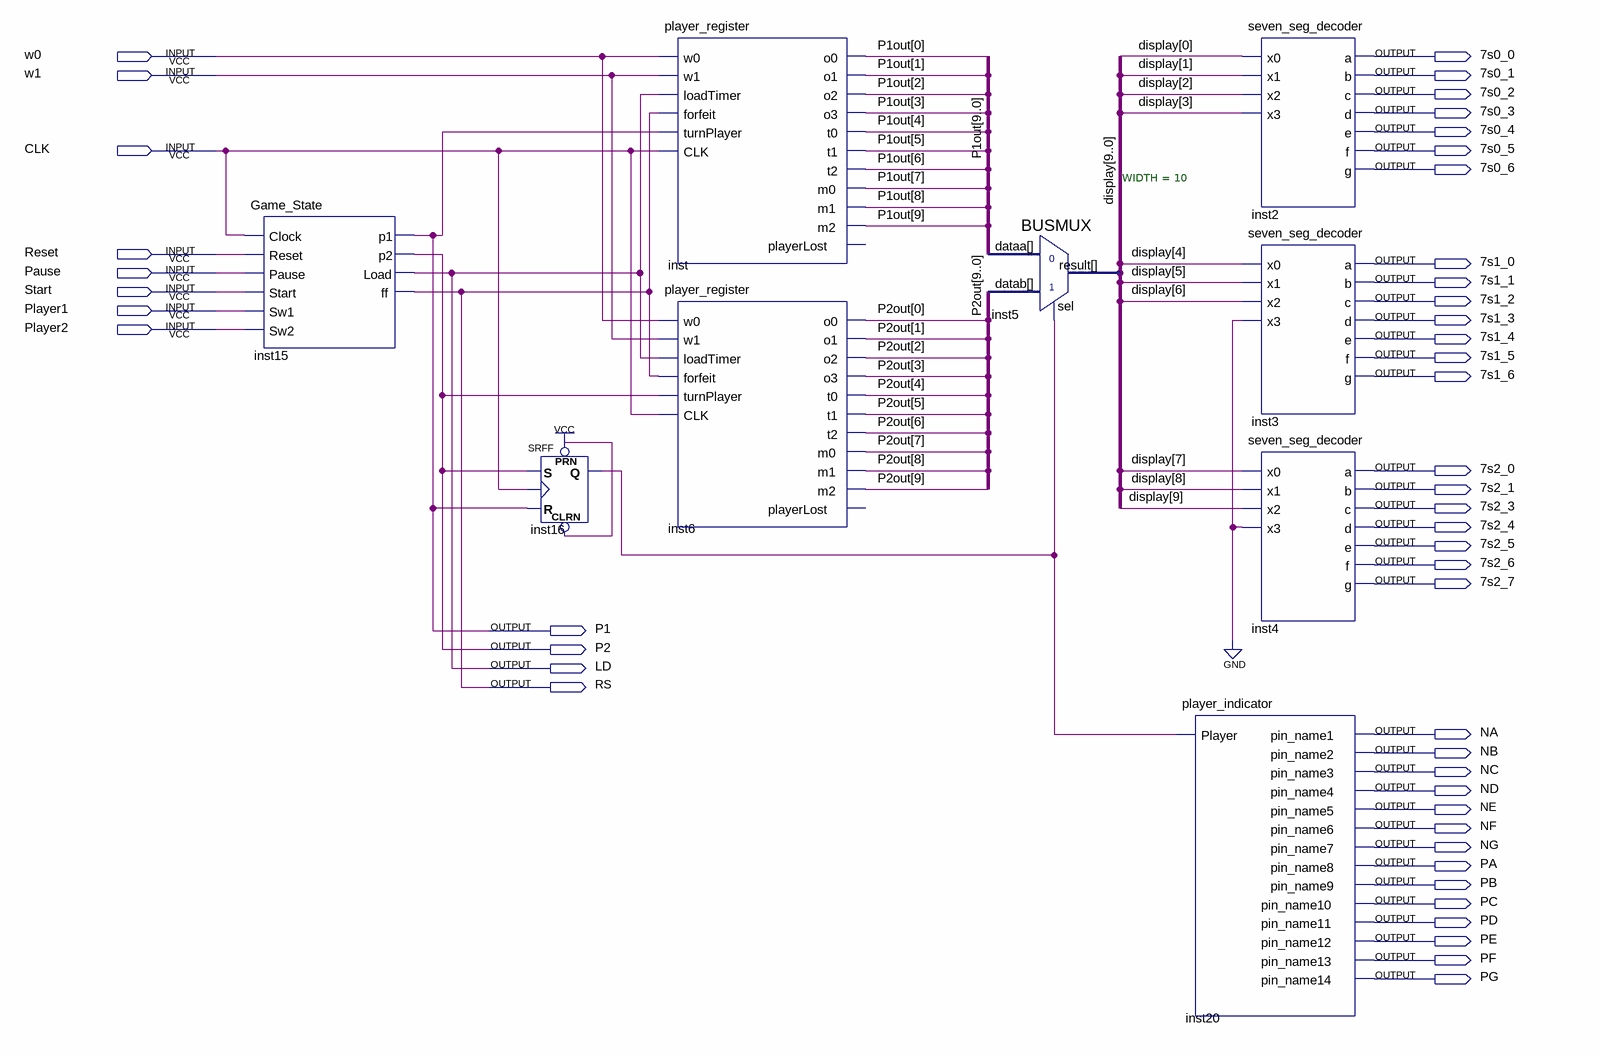
[diagram p0: schematic sheet]
// Quartus schematic finalproject.bdf as structural Verilog: 9 symbols, 47 pins
module finalproject (
  input  w0,
  input  w1,
  input  CLK,
  input  Reset,
  input  Pause,
  input  Start,
  input  Player1,
  input  Player2,
  output \7s0_0 ,
  output \7s0_1 ,
  output \7s0_2 ,
  output \7s0_3 ,
  output \7s0_4 ,
  output \7s0_5 ,
  output \7s0_6 ,
  output \7s1_0 ,
  output \7s1_1 ,
  output \7s1_2 ,
  output \7s1_3 ,
  output \7s1_4 ,
  output \7s1_5 ,
  output \7s1_6 ,
  output \7s2_0 ,
  output \7s2_1 ,
  output \7s2_3 ,
  output \7s2_4 ,
  output \7s2_5 ,
  output \7s2_6 ,
  output \7s2_7 ,
  output P1,
  output P2,
  output LD,
  output RS,
  output NA,
  output NB,
  output NC,
  output ND,
  output NE,
  output NF,
  output NG,
  output PA,
  output PB,
  output PC,
  output PD,
  output PE,
  output PF,
  output PG
);

  wire inst16_q;
  wire [9:0] display, P1out, P2out;

  Game_State inst15 (
    .Clock(CLK), .Reset(Reset), .Pause(Pause), .Start(Start), .Sw1(Player1), .Sw2(Player2), .p1(P1), .p2(P2),
    .Load(LD), .ff(RS));
  SRFF inst16 (.PRN(1'b1), .CLRN(1'b1), .S(P2), .R(P1), .CLK(CLK), .Q(inst16_q));
  player_register inst (
    .w0(w0), .w1(w1), .loadTimer(LD), .forfeit(RS), .turnPlayer(P1), .CLK(CLK), .o0(P1out[0]), .o1(P1out[1]),
    .o2(P1out[2]), .o3(P1out[3]), .t0(P1out[4]), .t1(P1out[5]), .t2(P1out[6]), .m0(P1out[7]), .m1(P1out[8]),
    .m2(P1out[9]));  // open: playerLost
  player_register inst6 (
    .w0(w0), .w1(w1), .loadTimer(LD), .forfeit(RS), .turnPlayer(P2), .CLK(CLK), .o0(P2out[0]), .o1(P2out[1]),
    .o2(P2out[2]), .o3(P2out[3]), .t0(P2out[4]), .t1(P2out[5]), .t2(P2out[6]), .m0(P2out[7]), .m1(P2out[8]),
    .m2(P2out[9]));  // open: playerLost
  BUSMUX #(.WIDTH(10)) inst5 (.datab(P2out), .sel(inst16_q), .dataa(P1out), .result(display));
  player_indicator inst20 (
    .Player(inst16_q), .pin_name1(NA), .pin_name2(NB), .pin_name3(NC), .pin_name4(ND), .pin_name5(NE),
    .pin_name6(NF), .pin_name7(NG), .pin_name8(PA), .pin_name9(PB), .pin_name10(PC), .pin_name11(PD),
    .pin_name12(PE), .pin_name13(PF), .pin_name14(PG));
  seven_seg_decoder inst2 (
    .x0(display[0]), .x1(display[1]), .x2(display[2]), .x3(display[3]), .a(\7s0_0 ), .b(\7s0_1 ),
    .c(\7s0_2 ), .d(\7s0_3 ), .e(\7s0_4 ), .f(\7s0_5 ), .g(\7s0_6 ));
  seven_seg_decoder inst3 (
    .x0(display[4]), .x1(display[5]), .x2(display[6]), .x3(1'b0), .a(\7s1_0 ), .b(\7s1_1 ), .c(\7s1_2 ),
    .d(\7s1_3 ), .e(\7s1_4 ), .f(\7s1_5 ), .g(\7s1_6 ));
  seven_seg_decoder inst4 (
    .x0(display[7]), .x1(display[8]), .x2(display[9]), .x3(1'b0), .a(\7s2_0 ), .b(\7s2_1 ), .c(\7s2_3 ),
    .d(\7s2_4 ), .e(\7s2_5 ), .f(\7s2_6 ), .g(\7s2_7 ));
endmodule
